# EAGLE design SLIM-PLO (EAGLE 6.1)
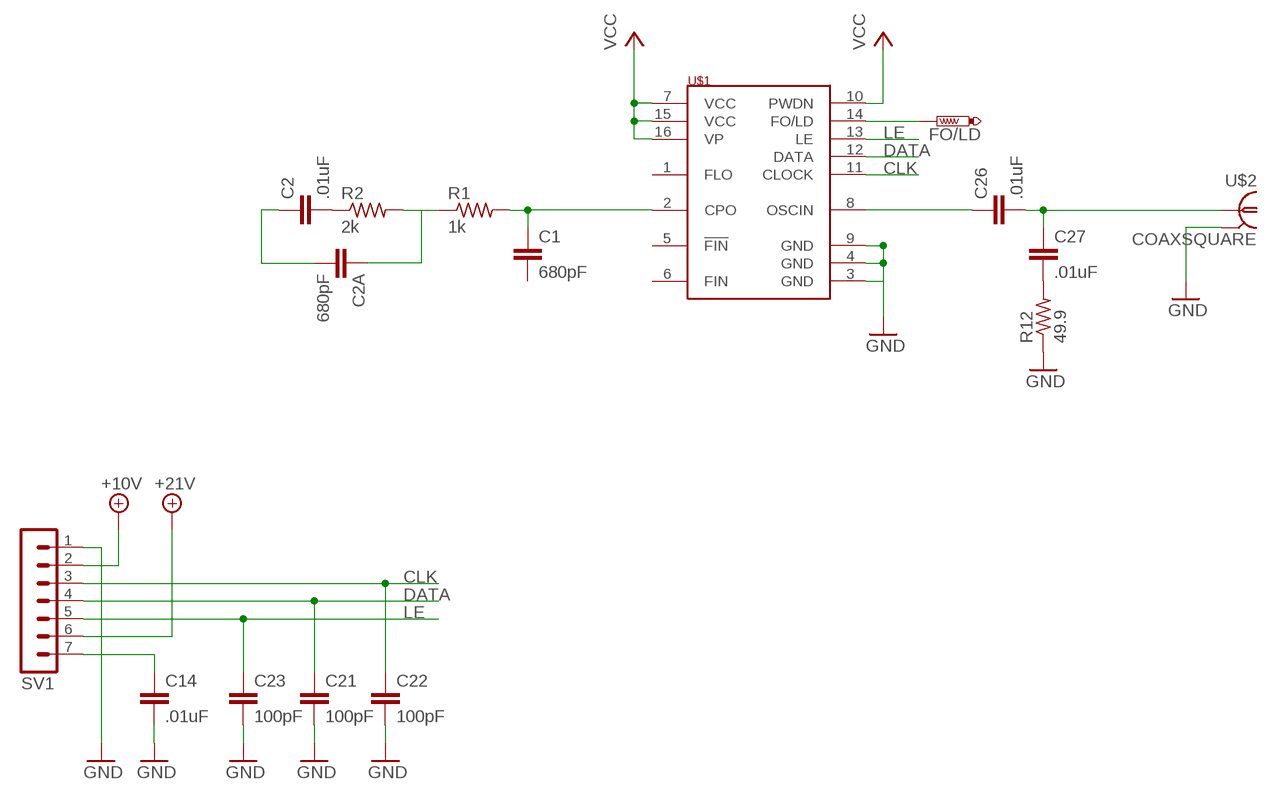
[diagram p0: schematic, sheet 1]

## Parts
C1  680pF  C-EUC0805  [C0805]
C2  .01uF  C-EUC0805  [C0805]
C2A  680pF  C-EUC0805  [C0805]
C14  .01uF  C-EUC0805  [C0805]
C21  100pF  C-EUC0805  [C0805]
C22  100pF  C-EUC0805  [C0805]
C23  100pF  C-EUC0805  [C0805]
C26  .01uF  C-EUC0805  [C0805]
C27  .01uF  C-EUC0805  [C0805]
FO/LD  PTR1B1,27  [B1,27]
R1  1k  R-US_M0805  [M0805]
R2  2k  R-US_M0805  [M0805]
R12  49.9  R-US_M0805  [M0805]
SV1  MA07-1  [MA07-1]
U$1  LMX2326  [TSSOP16]
U$2  COAXSQUARE  COAX  [SLIM_COAX_PAD]

## Nets
+10V: SV1.2
+21V: SV1.6
CLK: C22.1 SV1.3 U$1.11(CLOCK)
DATA: C21.1 SV1.4 U$1.12(DATA)
GND: C14.2 C21.2 C22.2 C23.2 R12.1 SV1.1 U$1.3(GND) U$1.4(GND) U$1.9(GND) U$2.P$2(GND)
LE: C23.1 SV1.5 U$1.13(LE)
N$1: FO/LD.TP U$1.14(FO/LD)
N$2: C14.1 SV1.7
N$3: C26.1 U$1.8(OSCIN)
N$4: C26.2 C27.1 U$2.P$1
N$5: C27.2 R12.2
N$6: C1.1 R1.2 U$1.2(CPO)
N$7: C2.2 R2.1
N$8: C2A.1 R1.1 R2.2
N$9: C2.1 C2A.2
VCC: U$1.7(VCC) U$1.10(PWDN) U$1.15(VCC) U$1.16(VP)
Unconnected: C1.2 U$1.1(FLO) U$1.5(!FIN) U$1.6(FIN)

## Library data of the parts
C1 C2 C2A C14 C21-C23 C26 C27 = rcl:C-EU: CAPACITOR, European symbol
FO/LD = testpad:PTR1: TEST PIN
R1 R2 R12 = rcl:R-US_: RESISTOR, American symbol
SV1 = con-lstb:MA07-1: PIN HEADER; OC_FARNELL: unknown; OC_NEWARK: unknown
U$1 = national-semiconductor:LMX2326
U$2 = SLIM:COAX

## Board
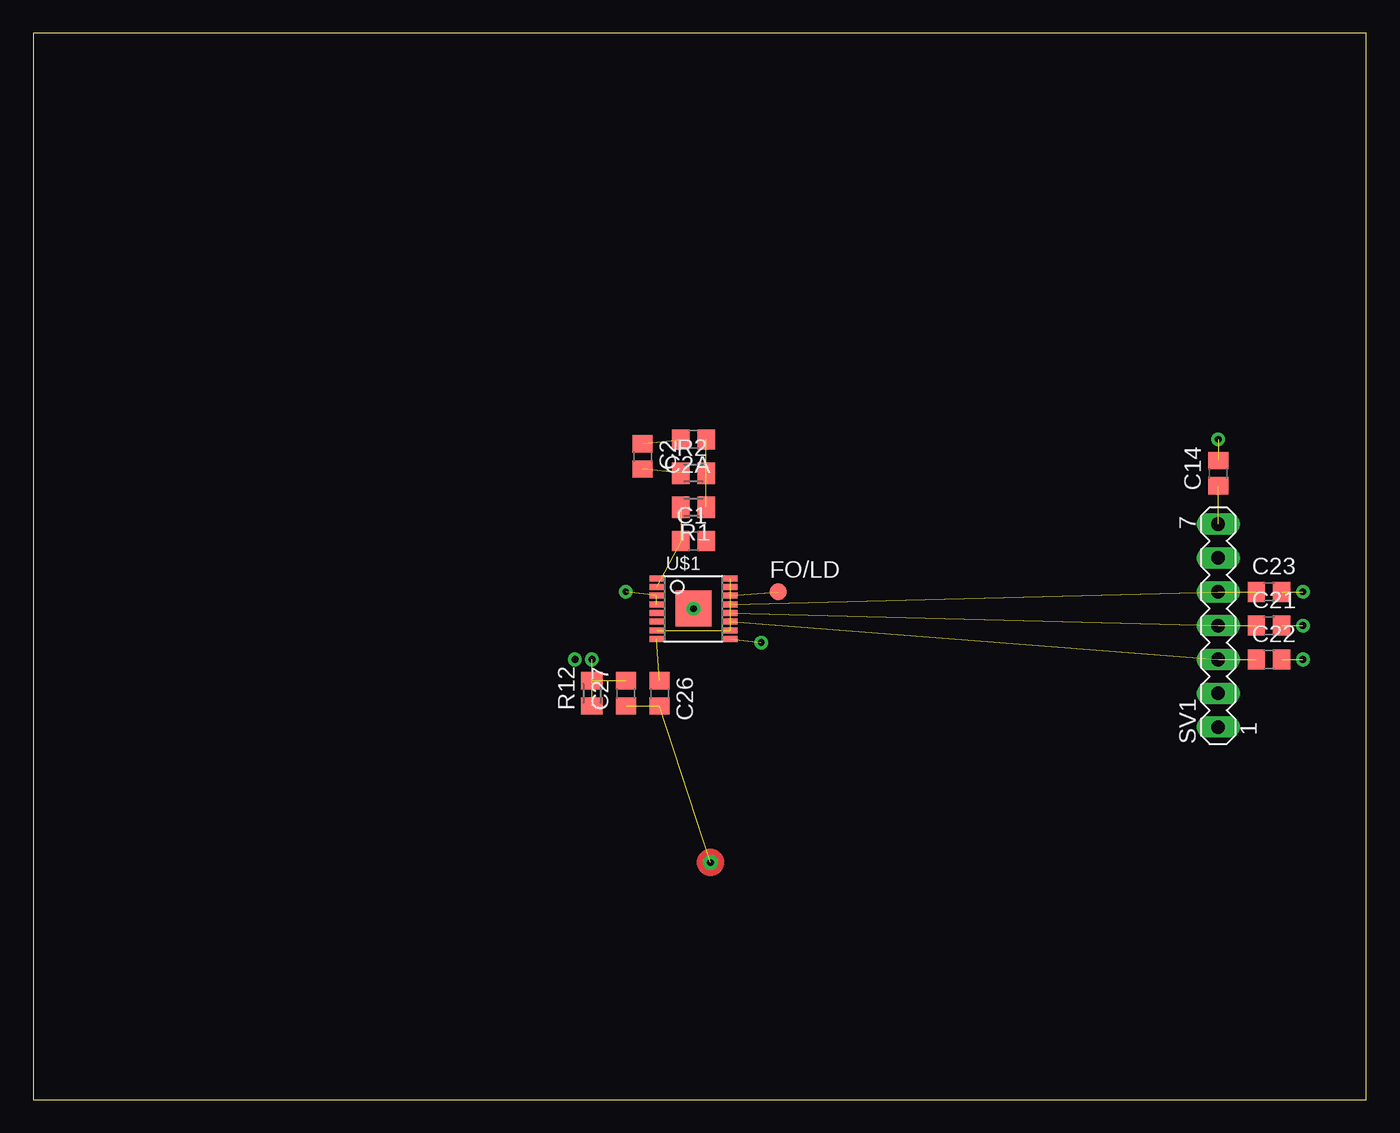
[diagram p1: board, top side]
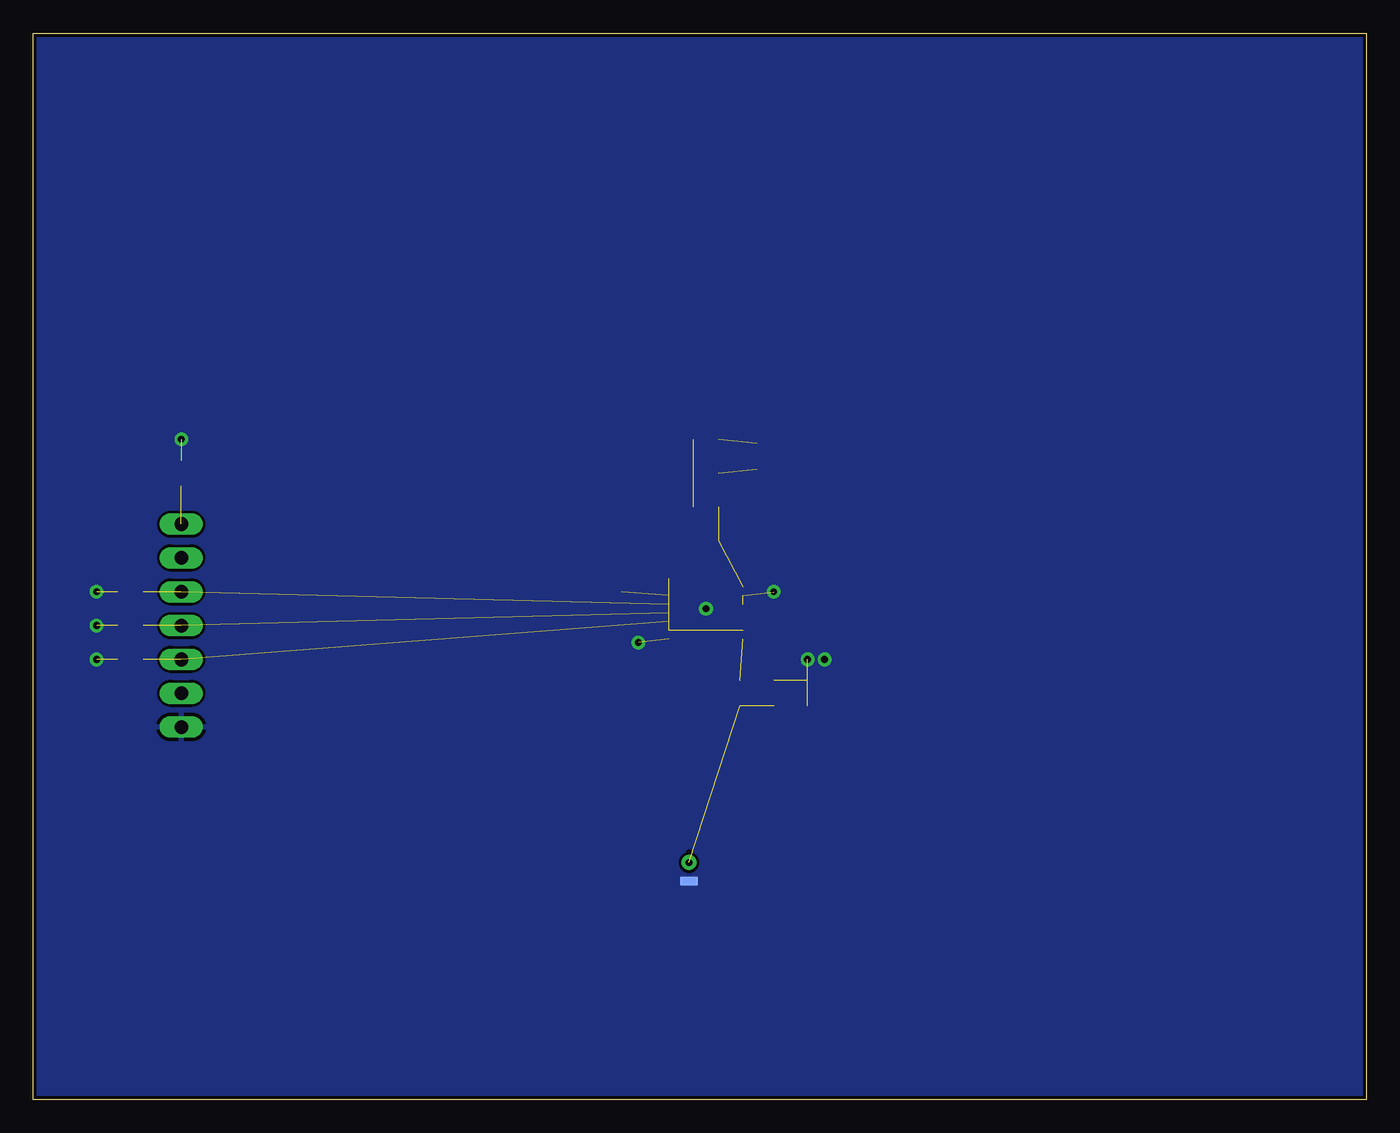
[diagram p2: board, bottom side, seen from below]

Size 100 x 80 mm. Coordinates in mm from the lower left corner, seen from the top.
Outline: 0,0 100,0 100,80 0,80 0,0
Copper layers (1*16): Top 0.035mm / dielectric 1.5mm / Bottom 0.035mm
Design rules: minimum track width 8mil, minimum drill 20mil, track to track 8mil, track to pad 8mil, pad to pad 8mil, via to via 8mil, smd to smd 8mil, copper to edge 10mil, drill to drill 8mil, minimum pad ring 12mil, minimum via ring 10mil, stop-mask expansion 4mil, vias tented up to drill 25mil, thermal gap 10mil

### Footprints (pad centres in the part's own frame; a part is rotated, then mirrored left to right if it is on the bottom)
C0805 = smd 1.3 x 1.5: 1 -0.95,0; 2 0.95,0
B1,27 = smd 1.27 x 1.27: TP 0,0
M0805 = smd 1.3 x 1.6: 1 -0.95,0; 2 0.95,0
MA07-1 = drill 1.016 long: 1 -7.62,0; 2 -5.08,0; 3 -2.54,0; 4 0,0; 5 2.54,0; 6 5.08,0; 7 7.62,0
TSSOP16@1 = smd 0.45 x 1.05: 1 -2.275,-2.768; 2 -1.625,-2.768; 3 -0.975,-2.768; 4 -0.325,-2.768; 5 0.325,-2.768; 6 0.975,-2.768; 7 1.625,-2.768; 8 2.275,-2.768; 9 2.275,2.768; 10 1.625,2.768; 11 0.975,2.768; 12 0.325,2.768; 13 -0.325,2.768; 14 -0.975,2.768; 15 -1.625,2.768; 16 -2.275,2.768 | smd 2.7 x 2.7: P$1 0,0
SLIM_COAX_PAD = drill 0.508 pad 1.016: P$1 0,0 | smd 1.27 x 0.635 bottom: P$2 0,-1.397

### Placement (x,y rotation side)
C1  49.53,41.91 0 top
C2  45.72,48.26 270 top
C2A  49.53,49.53 180 top
C14  88.9,46.99 90 top
C21  92.71,35.56 0 top
C22  92.71,33.02 0 top
C23  92.71,38.1 0 top
C26  46.99,30.48 270 top
C27  44.45,30.48 90 top
FO/LD  55.88,38.1 0 top
R1  49.53,44.45 180 top
R2  49.53,46.99 0 top
R12  41.91,30.48 90 top
SV1  88.9,35.56 90 top
U$1  LMX2326  [TSSOP16@1]  49.53,36.83 270 top
U$2  50.8,17.78 0 top

### Tracks (layer width: path | path; a pad name or v marks a point on that pad's centre or on a via)
CLK  (2 unrouted)
DATA  (2 unrouted)
GND  (via drill 0.51)  (8 unrouted)
  other vias: 40.64,33.02 41.91,33.02 44.45,38.1 54.61,34.29 49.53,36.83 88.9,49.53 95.25,38.1 95.25,35.56 95.25,33.02
  pour Bottom: 0,80.01 100.33,80.01 100.33,0 0,0
LE  (2 unrouted)
N$1  (1 unrouted)
N$2  (1 unrouted)
N$3  (1 unrouted)
N$4  (2 unrouted)
N$5  (1 unrouted)
N$6  (2 unrouted)
N$7  (1 unrouted)
N$8  (2 unrouted)
N$9  (1 unrouted)
VCC  (3 unrouted)